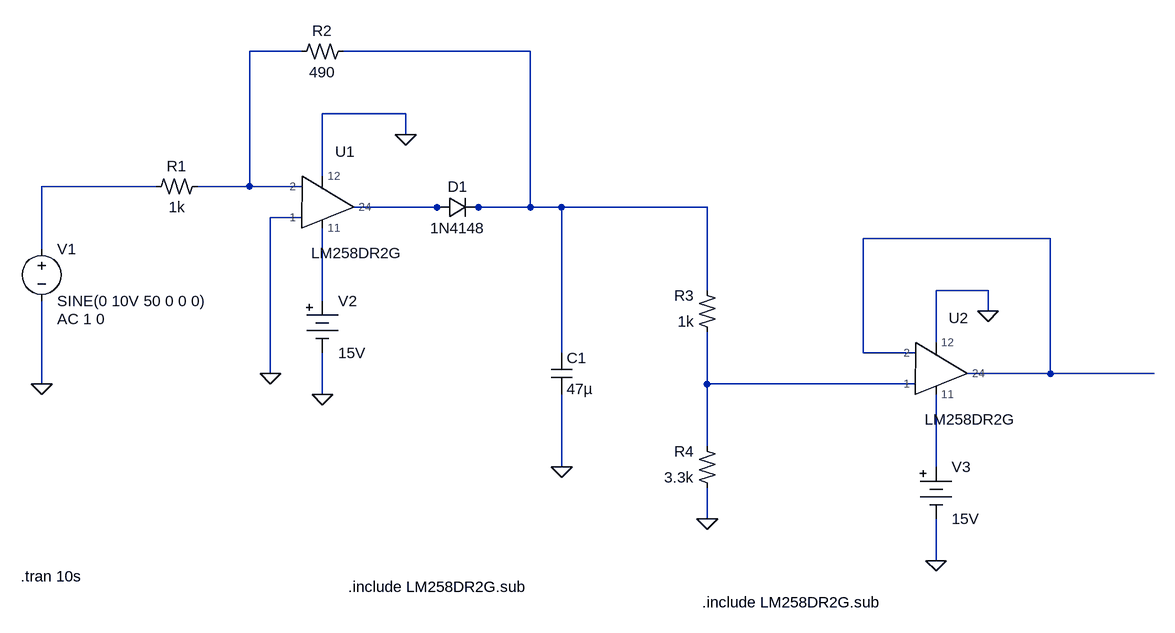
[diagram p0: schematic 10ACto3.3DC (second version) .asc]
10ACto3.3DC (second version) .asc, the LTspice schematic file:
Version 4
SHEET 1 1124 752
WIRE -192 -112 -272 -112
WIRE 160 -112 -128 -112
WIRE -32 -16 -160 -16
WIRE -32 16 -32 -16
WIRE -160 80 -160 -16
WIRE -416 96 -592 96
WIRE -272 96 -272 -112
WIRE -272 96 -352 96
WIRE -192 96 -272 96
WIRE 16 128 -112 128
WIRE 32 128 16 128
WIRE 80 128 64 128
WIRE 160 128 160 -112
WIRE 160 128 80 128
WIRE 208 128 160 128
WIRE 432 128 208 128
WIRE -192 144 -240 144
WIRE 960 176 672 176
WIRE -592 192 -592 96
WIRE 432 256 432 128
WIRE 864 256 784 256
WIRE -160 272 -160 160
WIRE 864 288 864 256
WIRE 784 336 784 256
WIRE 208 352 208 128
WIRE 672 352 672 176
WIRE 752 352 672 352
WIRE -240 384 -240 144
WIRE 960 384 960 176
WIRE 960 384 832 384
WIRE 1120 384 960 384
WIRE -592 400 -592 272
WIRE 432 400 432 320
WIRE 752 400 432 400
WIRE -160 416 -160 352
WIRE 432 496 432 400
WIRE 208 528 208 416
WIRE 784 528 784 416
WIRE 432 608 432 560
WIRE 784 672 784 608
FLAG -592 400 0
FLAG -240 384 0
FLAG -160 416 0
FLAG 208 528 0
FLAG 432 608 0
FLAG 784 672 0
FLAG -32 16 0
FLAG 864 288 0
SYMBOL voltage -592 176 R0
WINDOW 123 24 124 Left 2
WINDOW 39 0 0 Left 0
SYMATTR Value2 AC 1 0
SYMATTR InstName V1
SYMATTR Value SINE(0 10V 50 0 0 0)
SYMBOL res2 -352 80 R90
WINDOW 0 0 32 VBottom 2
WINDOW 3 32 32 VTop 2
SYMATTR InstName R1
SYMATTR Value 1k
SYMBOL res2 -128 -128 R90
WINDOW 0 0 32 VBottom 2
WINDOW 3 32 32 VTop 2
SYMATTR InstName R2
SYMATTR Value 490
SYMBOL res2 448 320 R180
WINDOW 0 36 56 Left 2
WINDOW 3 36 16 Left 2
SYMATTR InstName R3
SYMATTR Value 1k
SYMBOL res2 448 560 R180
WINDOW 0 36 56 Left 2
WINDOW 3 36 16 Left 2
SYMATTR InstName R4
SYMATTR Value 3.3k
SYMBOL cap 192 352 R0
SYMATTR InstName C1
SYMATTR Value 47µ
SYMBOL LM258DR2G -336 128 R0
SYMATTR InstName U1
SYMBOL LM258DR2G 608 384 R0
SYMATTR InstName U2
SYMBOL Misc\\battery -160 256 R0
WINDOW 123 0 0 Left 0
WINDOW 39 0 0 Left 0
SYMATTR InstName V2
SYMATTR Value 15V
SYMBOL Misc\\battery 784 512 R0
WINDOW 123 0 0 Left 0
WINDOW 39 0 0 Left 0
SYMATTR InstName V3
SYMATTR Value 15V
SYMBOL diode 16 144 R270
WINDOW 0 32 32 VTop 2
WINDOW 3 0 32 VBottom 2
SYMATTR InstName D1
SYMATTR Value 1N4148
TEXT -624 696 Left 2 !.tran 10s
TEXT -120 712 Left 2 !.include LM258DR2G.sub
TEXT 424 736 Left 2 !.include LM258DR2G.sub

The netlist it stands for:
* 10ACto3.3DC (second version) .asc
V1 N003 0 SINE(0 10V 50 0 0 0) AC 1 0
R1 N001 N003 1k
R2 N002 N001 490
R3 N007 N002 1k
R4 0 N007 3.3k
C1 N002 0 47µ
XU1 0 N001 N006 0 N004 LM258DR2G  ; pins 1 2 11 12 24
XU2 N007 N005 N008 0 N005 LM258DR2G  ; pins 1 2 11 12 24
V2 N006 0 15V
V3 N008 0 15V
D1 N004 N002 1N4148
.model D D
.lib standard.dio
.tran 10s
.include LM258DR2G.sub
.include LM258DR2G.sub
.lib H:\D5\Interface\Ltspice Model\LM258DR2G.sub
.backanno
.end